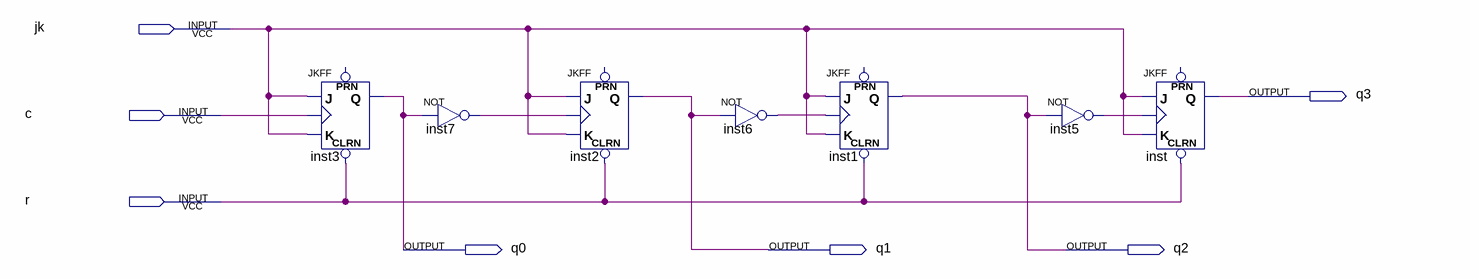
[diagram p0: schematic sheet]
// Quartus schematic Counter4_JKFF.bdf as structural Verilog: 7 symbols, 7 pins
module Counter4_JKFF (
  input  jk,
  input  c,
  input  r,
  output q3,
  output q0,
  output q1,
  output q2
);

  wire inst5_out, inst6_out, inst7_out;

  JKFF inst3 (.CLRN(r), .K(jk), .J(jk), .CLK(c), .Q(q0));  // open: PRN
  not inst7 (inst7_out, q0);
  JKFF inst2 (.CLRN(r), .K(jk), .J(jk), .CLK(inst7_out), .Q(q1));  // open: PRN
  not inst6 (inst6_out, q1);
  JKFF inst1 (.CLRN(r), .K(jk), .J(jk), .CLK(inst6_out), .Q(q2));  // open: PRN
  not inst5 (inst5_out, q2);
  JKFF inst (.CLRN(r), .K(jk), .J(jk), .CLK(inst5_out), .Q(q3));  // open: PRN
endmodule
